# Altium schematic sheet nRF53.SchDoc: nRF5340
size B; DrawnBy: Sindre Hovland; Organization: Advanced Wearables Nordic Semi; Revision: V1; SheetNumber: 1; SheetTotal: 1
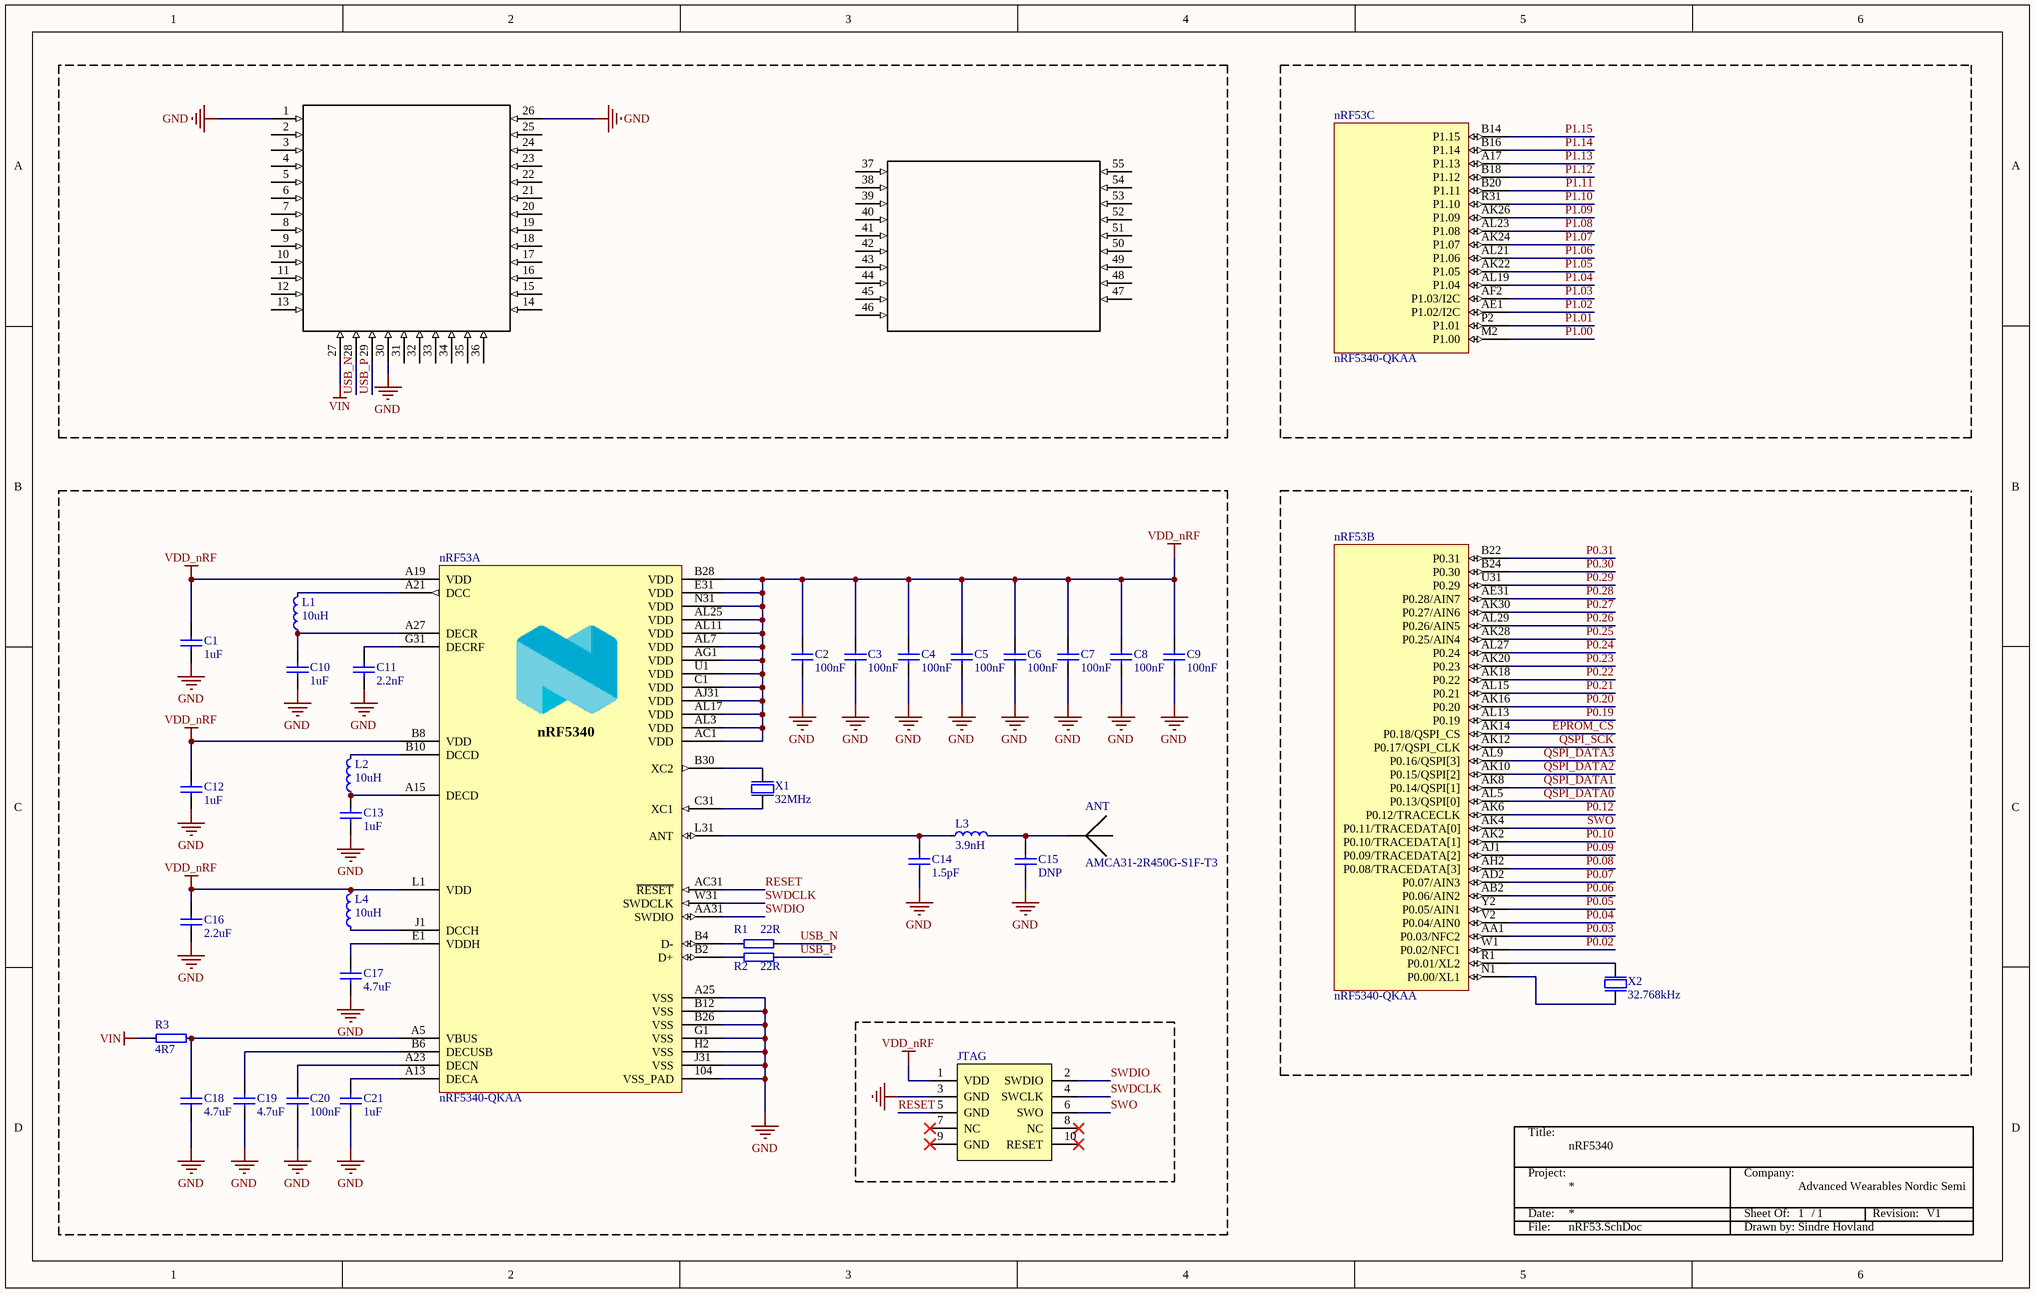
[diagram p0: nRF53.SchDoc]

## Parts
*  TitleBlock  (value not drawn)  (graphical)
ANT  AMCA31-2R450G-S1F-T3  [AMCA31-2R450G-S1F-T3]
C1  1uF  [C0201]
C2  100nF  [C0201]
C3  100nF  [C0201]
C4  100nF  [C0201]
C5  100nF  [C0201]
C6  100nF  [C0201]
C7  100nF  [C0201]
C8  100nF  [C0201]
C9  100nF  [C0201]
C10  1uF  [C0201]
C11  2.2nF  [C0201]
C12  1uF  [C0201]
C13  1uF  [C0201]
C14  1.5pF  [C0201]
C15  DNP  [C0201]
C16  2.2uF  [C0402]
C17  4.7uF  [C0402]
C18  4.7uF  [C0402]
C19  4.7uF  [C0402]
C20  100nF  [C0201]
C21  1uF  [C0201]
JTAG  DNP  [JTAG Pins 6]  (value not drawn)
L1  10uH  [IND0603]
L2  10uH  [IND0603]
L3  3.9nH  [IND0201]
L4  10uH  [IND0603]
nRF53  nRF5340-QKAA  [nRF5340]  (parts A,B,C of 3)
nRF53-Module  DNP  [nRF53Module]  (value not drawn)  (parts A,B of 2)
R1  22R  [R0201]
R2  22R  [R0201]
R3  4R7  [R0201]
X1  32MHz  [XTAL_2016]
X2  32.768kHz  [XTAL_2012]

## Nets
GND: ANT.2(GND) C1.1 C2.1 C3.1 C4.1 C5.1 C6.1 C7.1 C8.1 C9.1 C10.1 C11.1 C12.1 C13.1 C14.1 C15.1 C16.1 C17.1 C18.1 C19.1 C20.1 C21.1 JTAG.3(GND) nRF53.104(VSS_PAD) nRF53.A25(VSS) nRF53.B12(VSS) nRF53.B26(VSS) nRF53.G1(VSS) nRF53.H2(VSS) nRF53.J31(VSS) nRF53-Module.1 nRF53-Module.26 nRF53-Module.30 X1.2(GND) X1.4(GND)
VDD_nRF: C1.2 C2.2 C3.2 C4.2 C5.2 C6.2 C7.2 C8.2 C9.2 C12.2 C16.2 JTAG.1(VDD) L4.2 nRF53.A19(VDD) nRF53.AC1(VDD) nRF53.AG1(VDD) nRF53.AJ31(VDD) nRF53.AL3(VDD) nRF53.AL7(VDD) nRF53.AL11(VDD) nRF53.AL17(VDD) nRF53.AL25(VDD) nRF53.B8(VDD) nRF53.B28(VDD) nRF53.C1(VDD) nRF53.E31(VDD) nRF53.L1(VDD) nRF53.N31(VDD) nRF53.U1(VDD)
VIN: nRF53-Module.27 R3.2
EPROM_CS: nRF53.AK14(P0.18/QSPI_CS)
P0.02: nRF53.W1(P0.02/NFC1)
P0.03: nRF53.AA1(P0.03/NFC2)
P0.04: nRF53.V2(P0.04/AIN0)
P0.05: nRF53.Y2(P0.05/AIN1)
P0.06: nRF53.AB2(P0.06/AIN2)
P0.07: nRF53.AD2(P0.07/AIN3)
P0.08: nRF53.AH2(P0.08/TRACEDATA[3])
P0.09: nRF53.AJ1(P0.09/TRACEDATA[2])
P0.10: nRF53.AK2(P0.10/TRACEDATA[1])
P0.12: nRF53.AK6(P0.12/TRACECLK)
P0.19: nRF53.AL13(P0.19)
P0.20: nRF53.AK16(P0.20)
P0.21: nRF53.AL15(P0.21)
P0.22: nRF53.AK18(P0.22)
P0.23: nRF53.AK20(P0.23)
P0.24: nRF53.AL27(P0.24)
P0.25: nRF53.AK28(P0.25/AIN4)
P0.26: nRF53.AL29(P0.26/AIN5)
P0.27: nRF53.AK30(P0.27/AIN6)
P0.28: nRF53.AE31(P0.28/AIN7)
P0.29: nRF53.U31(P0.29)
P0.30: nRF53.B24(P0.30)
P0.31: nRF53.B22(P0.31)
P1.00: nRF53.M2(P1.00)
P1.01: nRF53.P2(P1.01)
P1.02: nRF53.AE1(P1.02/I2C)
P1.03: nRF53.AF2(P1.03/I2C)
P1.04: nRF53.AL19(P1.04)
P1.05: nRF53.AK22(P1.05)
P1.06: nRF53.AL21(P1.06)
P1.07: nRF53.AK24(P1.07)
P1.08: nRF53.AL23(P1.08)
P1.09: nRF53.AK26(P1.09)
P1.10: nRF53.R31(P1.10)
P1.11: nRF53.B20(P1.11)
P1.12: nRF53.B18(P1.12)
P1.13: nRF53.A17(P1.13)
P1.14: nRF53.B16(P1.14)
P1.15: nRF53.B14(P1.15)
QSPI_DATA0: nRF53.AL5(P0.13/QSPI[0])
QSPI_DATA1: nRF53.AK8(P0.14/QSPI[1])
QSPI_DATA2: nRF53.AK10(P0.15/QSPI[2])
QSPI_DATA3: nRF53.AL9(P0.16/QSPI[3])
QSPI_SCK: nRF53.AK12(P0.17/QSPI_CLK)
RESET: JTAG.5(GND) nRF53.AC31(~{RESET})
SWDCLK: JTAG.4(SWCLK) nRF53.W31(SWDCLK)
SWDIO: JTAG.2(SWDIO) nRF53.AA31(SWDIO)
SWO: JTAG.6(SWO) nRF53.AK4(P0.11/TRACEDATA[0])
USB_N: nRF53-Module.28 R1.2
USB_P: nRF53-Module.29 R2.2
NetANT_1: ANT.1 C15.2 L3.2
NetC10_2: C10.2 L1.1 nRF53.A27(DECR)
NetC11_2: C11.2 nRF53.G31(DECRF)
NetC13_2: C13.2 L2.1 nRF53.A15(DECD)
NetC14_2: C14.2 L3.1 nRF53.L31(ANT)
NetC17_2: C17.2 nRF53.E1(VDDH)
NetC18_2: C18.2 nRF53.A5(VBUS) R3.1
NetC19_2: C19.2 nRF53.B6(DECUSB)
NetC20_2: C20.2 nRF53.A23(DECN)
NetC21_2: C21.2 nRF53.A13(DECA)
NetL1_2: L1.2 nRF53.A21(DCC)
NetL2_2: L2.2 nRF53.B10(DCCD)
NetL4_1: L4.1 nRF53.J1(DCCH)
NetnRF53_B2: nRF53.B2(D+) R2.1
NetnRF53_B4: nRF53.B4(D-) R1.1
NetnRF53_B30: nRF53.B30(XC2) X1.3(out)
NetnRF53_C31: nRF53.C31(XC1) X1.1(inp)
NetnRF53_N1: nRF53.N1(P0.00/XL1) X2.2(out)
NetnRF53_R1: nRF53.R1(P0.01/XL2) X2.1(inp)

Not connected (* = marked no-connect by the designer): JTAG 7(NC)* 8(NC)* 9(GND)* 10(RESET)*; nRF53 AG31(N.C.) D2(N.C.) F2(N.C.) T2(N.C.); nRF53-Module 2 3 4 5 6 7 8 9 10 11 12 13 14 15 16 17 18 19 20 21 22 23 24 25 31 32 33 34 35 36 37 38 39 40 41 42 43 44 45 46 47 48 49 50 51 52 53 54 55

## Notes on the sheet
- (in symbol nRF5340-QKAAAA, part A) nRF5340
- (in symbol TitleBlock) Title:; Project:; Company:; Date:; Sheet Of:; /; Revision:; File:; Drawn by:

## Library data of the parts
ANT = Antenna with GND: 2.45 GHz chip antenna; Part Number: Johanson 2450AT18D0100_STD-L; Manufacturer: Johanson Technology; Manufacturer Part Number: 2450AT18D0100; Part number IPS: N.A.; Value: 2450AT18D0100; Artikkelnr Noca: 53059035; ComponentLink1URL: *; ComponentLink1Description: Datasheet; ComponentLink2URL: *; ComponentLink2Description: Supplier link; HelpURL: http://www.johansontechnology.com/datasheets/antennas/2450AT18D0100.pdf; Footprint Doc: 2450AT18D0100; LatestRevisionDate: 2016-06-02; Pin Count: 4; Publisher: Nordic Semiconductor; Published: 2016-01-12; Note: *; Supplier 1: Digi-Key; Supplier Part Number 1: 2450AT18D0100E; Supplier 2: Mouser; Supplier Part Number 2: 609-2450AT18D0100E
C1-C21 = CAP: Capacitor; Value: 100pF; Published: 8-Jun-2000; Revision: July-2002: Re-released for DXP Platform.; Publisher: Altium Limited
JTAG = JTAG: Pin Header 2x5, 1.27mm (50mil), SMD, Keying Shroud; Part Number: Pin Header 2x5 SMD, 1.27mm, KS; Manufacturer: W-CON; Manufacturer Part Number: 3132-10MS0BK00R1; Part number IPS: N.A.; Artikkelnr Noca: 55010009; Footprint Doc: HDR_2x5-SMD-1.27mm; LatestRevisionDate: 2016-04-21; Pin Count: 10; Publisher: Nordic Semiconductor; Published: 2016-01-22; Value: Pin Header 2x5, 1.27mm; Note: *; ComponentLink1URL: *; ComponentLink1Description: Datasheet; ComponentLink2URL: *; ComponentLink2Description: Supplier link; HelpURL: \\hizz\pro\app9717\Datasheet\connectores\W-CON\3132-XXMXXBK00XX.pdf; Supplier 1: Cabcon; Supplier Part Number 1: 3132-10MS0BK00R1; Supplier 2: Samtec; Supplier Part Number 2: FTSH-105-01-F-DV-K
L1-L4 = IND: Inductor; Part Number: FB0402-120R@100M-500mA; Manufacturer: Murata; Manufacturer Part Number: BLM15AG121SN1D; Part number IPS: N.A.; Value: 120R/0.55A; Note: Chip EMIFIL Inductor Type Chip Ferrite Bead; Artikkelnr Noca: 33029317; Footprint Doc: 0402; LatestRevisionDate: 2014-01-10; Pin Count: 2; Publisher: Nordic Semiconductor; Published: 2011-11-14; ComponentLink1URL: *; ComponentLink1Description: Datasheet; ComponentLink2URL: *; ComponentLink2Description: Supplier link; HelpURL: http://search.murata.co.jp/Ceramy/image/img/PDF/ENG/L0110S0100BLM15A_SN.pdf
nRF53 = nRF5340-QKAAAA: Multi-protocol Bluetooth Low Energy, IEEE 802.15.4, ANT and 2.4GHz proprietary system-on-chip; Part Number: nRF5340-QKAADA; Manufacturer: Nordic Semiconductor; Artikkelnr Noca: N.A.; Footprint Doc: AQFN-98; LatestRevisionDate: 2019-03-28; Pin Count: 98; Published: 2017-01-09; Value: nRF5340-QKAA; Manufacturer Part Number: *; ComponentLink1URL: *; ComponentLink1Description: Datasheet; ComponentLink2URL: *; ComponentLink2Description: Supplier link; HelpURL: *; Publisher: Nordic Semiconductor; Note: *; Supplier 1: Nordic Semiconductor; Supplier Part Number 1: nRF5340-QKAADA; Supplier 2: *; Supplier Part Number 2: *; Part number IPS: N.A.
nRF53-Module = nRF53-Module
R1-R3 = RES: Resistor, ±5%, 0.05W; Part Number: R0201-0R; Part number IPS: 00000003245; Value: 0R; Note: Chip Res 5%; Artikkelnr Noca: N.A.; Manufacturer: *; Manufacturer Part Number: *; ComponentLink1URL: *; ComponentLink1Description: Datasheet; ComponentLink2URL: *; ComponentLink2Description: Supplier link; HelpURL: *; Footprint Doc: 0201; LatestRevisionDate: 2017-11-09; Pin Count: 2; Publisher: Nordic Semiconductor; Published: 2014-11-13; Supplier 1: *; Supplier Part Number 1: *; Supplier 2: *; Supplier Part Number 2: *
X1 = XTAL_SMD2016: XTAL SMD 2016, 32MHz, Cl=8pF, Total Tol: ±40ppm; Part Number: XTAL_SMD2016_32MHz_8pF_General; LatestRevisionDate: 2016-08-19; Pin Count: 4; Publisher: Nordic Semiconductor; Published: 2016-08-19; Value: 32MHz; Footprint Doc: XTAL_2016; Manufacturer: *; Manufacturer Part Number: *
X2 = XTAL_2-pin: XTAL SMD 32.768kHz, 9pF, ±20ppm; Part Number: XTAL_SMD3215_32.768kHz_9pF_NDK; Manufacturer: NDK; Manufacturer Part Number: NX3215SA-32.768K-STD-MUA-9; Part number IPS: N.A.; Artikkelnr Noca: 22010049; LatestRevisionDate: 2017-10-23; Pin Count: 2; Publisher: Nordic Semiconductor; Published: 2017-10-23; Value: 32.768kHz; Note: XTAL SMD 32.768kHz; Footprint Doc: XTAL_3215; ComponentLink1URL: *; ComponentLink1Description: Datasheet; ComponentLink2URL: *; ComponentLink2Description: Supplier link; HelpURL: *; Supplier 1: Digi-Key; Supplier Part Number 1: 535-11937-6-ND